# Altium schematic sheet MAIN_STM32L476RGT6.SchDoc
size B; SheetNumber: 4
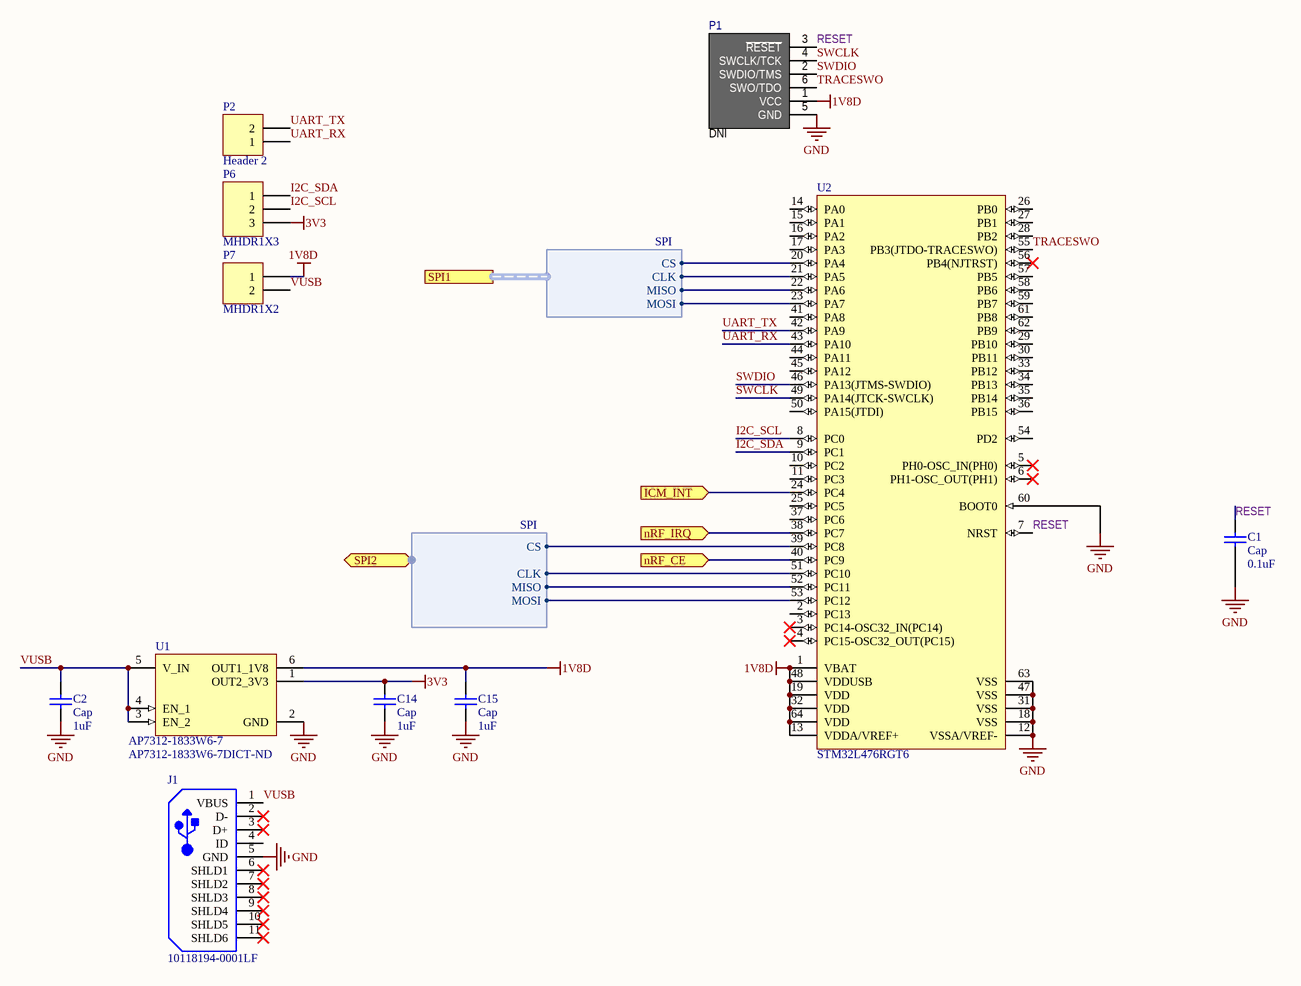
[diagram p0: MAIN_STM32L476RGT6.SchDoc]

## Parts
C1  Cap  value 0.1uF  [CAPC1005N]
C2  Cap  value 1uF  [CAPC1005N]
C14  Cap  value 1uF  [CAPC1005N]
C15  Cap  value 1uF  [CAPC1005N]
J1  10118194-0001LF  [FCI-10118194-0001LF-5_V]
P1  DNI  [TC2030]  (no BOM)
P2  Header 2  [HDR1X2-PINS]
P6  MHDR1X3  [MHDR1X3]
P7  MHDR1X2  [MHDR1X2]
U1  AP7312-1833W6-7  Supplier Part Number 1: AP7312-1833W6-7DICT-ND  [SOT95P285X145-6N]
U2  STM32L476RGT6  [STM-LQFP64_N]

## Ports
ICM_INT (in), nRF_CE (in), nRF_IRQ (in), SPI1 (harness SPI), SPI2 (bidir, harness SPI)

## Harnesses
SPI: MOSI, MISO, CS, CLK

## Nets
1V8D: C15.2 P1.1(VCC) P7.1 U1.6(OUT1_1V8) U2.1(VBAT) U2.13(VDDA/VREF+) U2.19(VDD) U2.32(VDD) U2.48(VDDUSB) U2.64(VDD)
3V3: C14.2 P6.3 U1.1(OUT2_3V3)
GND: C1.1 C2.1 C14.1 C15.1 J1.5(GND) P1.5(GND) U1.2(GND) U2.12(VSSA/VREF-) U2.18(VSS) U2.31(VSS) U2.47(VSS) U2.60(BOOT0) U2.63(VSS)
I2C_SCL: P6.2 U2.8(PC0)
I2C_SDA: P6.1 U2.9(PC1)
ICM_INT: U2.24(PC4) ; port ICM_INT
nRF_CE: U2.40(PC9) ; port nRF_CE
nRF_IRQ: U2.38(PC7) ; port nRF_IRQ
RESET: C1.2 P1.3(~{RESET}) U2.7(NRST)
SWCLK: P1.4(SWCLK/TCK) U2.49(PA14(JTCK-SWCLK))
SWDIO: P1.2(SWDIO/TMS) U2.46(PA13(JTMS-SWDIO))
TRACESWO: P1.6(SWO/TDO) U2.55(PB3(JTDO-TRACESWO))
UART_RX: P2.1 U2.43(PA10)
UART_TX: P2.2 U2.42(PA9)
VUSB: C2.2 J1.1(VBUS) P7.2 U1.3(EN_2) U1.4(EN_1) U1.5(V_IN)
NetU2_20: U2.20(PA4) ; port SPI1.CS
NetU2_21: U2.21(PA5) ; port SPI1.CLK
NetU2_22: U2.22(PA6) ; port SPI1.MISO
NetU2_23: U2.23(PA7) ; port SPI1.MOSI
NetU2_39: U2.39(PC8) ; port SPI2.CS
NetU2_51: U2.51(PC10) ; port SPI2.CLK
NetU2_52: U2.52(PC11) ; port SPI2.MISO
NetU2_53: U2.53(PC12) ; port SPI2.MOSI

Not connected (* = marked no-connect by the designer): J1 2(D-)* 3(D+)* 4(ID) 6(SHLD1)* 7(SHLD2)* 8(SHLD3)* 9(SHLD4)* 10(SHLD5)* 11(SHLD6)*; U2 2(PC13) 3(PC14-OSC32_IN(PC14))* 4(PC15-OSC32_OUT(PC15))* 5(PH0-OSC_IN(PH0))* 6(PH1-OSC_OUT(PH1))* 10(PC2) 11(PC3) 14(PA0) 15(PA1) 16(PA2) 17(PA3) 25(PC5) 26(PB0) 27(PB1) 28(PB2) 29(PB10) 30(PB11) 33(PB12) 34(PB13) 35(PB14) 36(PB15) 37(PC6) 41(PA8) 44(PA11) 45(PA12) 50(PA15(JTDI)) 54(PD2) 56(PB4(NJTRST))* 57(PB5) 58(PB6) 59(PB7) 61(PB8) 62(PB9)

## Library data of the parts
C1 C2 C14 C15 = Cap: Capacitor; Published: 8-Jun-2000; LatestRevisionDate: 17-Jul-2002; LatestRevisionNote: Re-released for DXP Platform.; PackageReference: RAD-0.3; Publisher: Altium Limited; PackageDescription: Radial Cap, Thru-Hole; 2 Leads; 0.3 in Pin Spacing
J1 = CMP-2000-05120-1: Micro USB B Type Receptacle, 1.8 A, -55 to 85 degC, 5-Pin SMD, RoHS, Tape and Reel; Manufacturer: Amphenol FCI; Body Orientation: RightAngle; Number of Contacts: 5; Pitch: 0.65mm; Gender: RCP; Rad Hard: No; Package Reference: 10118194-0001LF-5; Mounting: SurfaceMount; Manufacturer URL: http://www.fci.com/; Packaging: CutTape; Datasheet URL: https://datasheet.ciiva.com/26945/getdatasheetpartid-418619-26945695.pdf; Termination Method: Solder; Package Description: 5-Pin Surface Mount Device, Body 8.05 x 5.53 mm, Pitch 0.65 mm; Type: MicroUSBTypeB; Datasheet Version: Rev. A, 10/2011
P1 = TC2030-CTX
P2 = Header 2: Header, 2-Pin; LatestRevisionDate: 17-Jul-2002; LatestRevisionNote: Re-released for DXP Platform.; Publisher: Altium Limited
P6 = MHDR1X3: Header, 3-Pin; LatestRevisionDate: 17-Jul-2002; LatestRevisionNote: Re-released for DXP Platform.; Publisher: Altium Limited
P7 = MHDR1X2: Header, 2-Pin; LatestRevisionDate: 17-Jul-2002; LatestRevisionNote: Re-released for DXP Platform.; Publisher: Altium Limited
U1 = AP7312-1833W6-7: IC REG LINEAR 1.8V/3.3V SOT26; Manufacturer 1: Diodes; Number of Outputs: 2; Min Input Voltage: 2V; Max Input Voltage: 6V; Max Output Current: 150mA; Max Power Dissipation: 950mW; Polarity: Positive; Quiescent Current: 80uA; Accuracy: 2%; Output Type: Fixed; Dropout Voltage: 150mV; Output Voltage: 3.3V; Min Current Limit: 200mA; Operating Supply Current: 60uA; Voltage - Output 1: 1.8V; Reference Voltage: 800mV; Power Supply Rejection Ratio (PSRR): 65dB; Supplier 1: Digi-Key; Manufacturer Part Number 1: AP7312-1833W6-7; Stock 1: 17585; Pricing 1: 1=0.59000, 10=0.52100, 100=0.37100, 500=0.29994, 1000=0.22890 (USD); RoHS: Yes; Mount: Surface Mount; Case/Package: SOT-26; Number of Pins: 6; Contact Plating: Tin,Matte; Min Operating Temperature: -40°C; Max Operating Temperature: 85°C; Output Current: 150mA; Package Quantity: 3000; Packaging: Tape and Reel; Power Rating: 950mW; Number of Regulators: 2; Current - Output 1: 150mA; Current - Output 2: 150mA; Voltage - Output 2: 3.3V; Power Dissipation: 950mW; Output Voltage Accuracy: 2%; Length: 3.1mm; Height: 1.3mm; Width: 1.7mm; Radiation Hardening: No; REACH SVHC: No SVHC; Lead Free: Lead Free; ComponentLink1URL: https://datasheet.ciiva.com/30477/0900766b8115c2c0-30477178.pdf?src-supplier=RSComponents; ComponentLink1Description: https://datasheet.ciiva.com/30477/0900766b8115c2c0-30477178.pdf?src-supplier=RSComponents; ComponentLink2URL: https://datasheet.ciiva.com/8078/1636610-8078247.pdf?src-supplier=Element14; ComponentLink2Description: https://datasheet.ciiva.com/8078/1636610-8078247.pdf?src-supplier=Element14; ComponentLink3URL: https://datasheet.ciiva.com/8239/ap7312-8239997.pdf?src-supplier=Avnet; ComponentLink3Description: https://datasheet.ciiva.com/8239/ap7312-8239997.pdf?src-supplier=Avnet
U2 = CMP-1655-00012-2: Ultra-Low-Power ARM Cortex-M4 32-bit MCU+FPU, 1024 KB Flash, 128 KB Internal RAM, 51 I/Os, 64-Pin LQFP, -40 to 85 degC, Tray; Manufacturer: STMicroelectronics; D/A Converter: 2; Supply Voltage(Vcc) min (V): 1.71; Internal RAM Size (kB): 128; Operating Frequency(F) (Processor speed) (MHz): 80; FLASH Size (Prog) (kB): 1024; I/Os (High Current): 51; Core: ARM Cortex-M4; Package Reference: LQFP64; DatasheetVersion: Rev. 4; ComponentLink1URL: http://www.st.com/; ComponentLink2Description: Datasheet; Mounting Technology: Surface Mount; Package Description: 64-Pin Low-profile Quad Flat Package, Body 10 x 10 mm, Pitch 0.5 mm; ComponentLink1Description: Manufacturer URL; ComponentLink2URL: http://www.st.com/st-web-ui/static/active/en/resource/technical/document/datasheet/DM00108832.pdf; Packing: Tray; PartNumber: STM32L476RGT6